# Altium schematic sheet instrumentacao.SchDoc
size A4
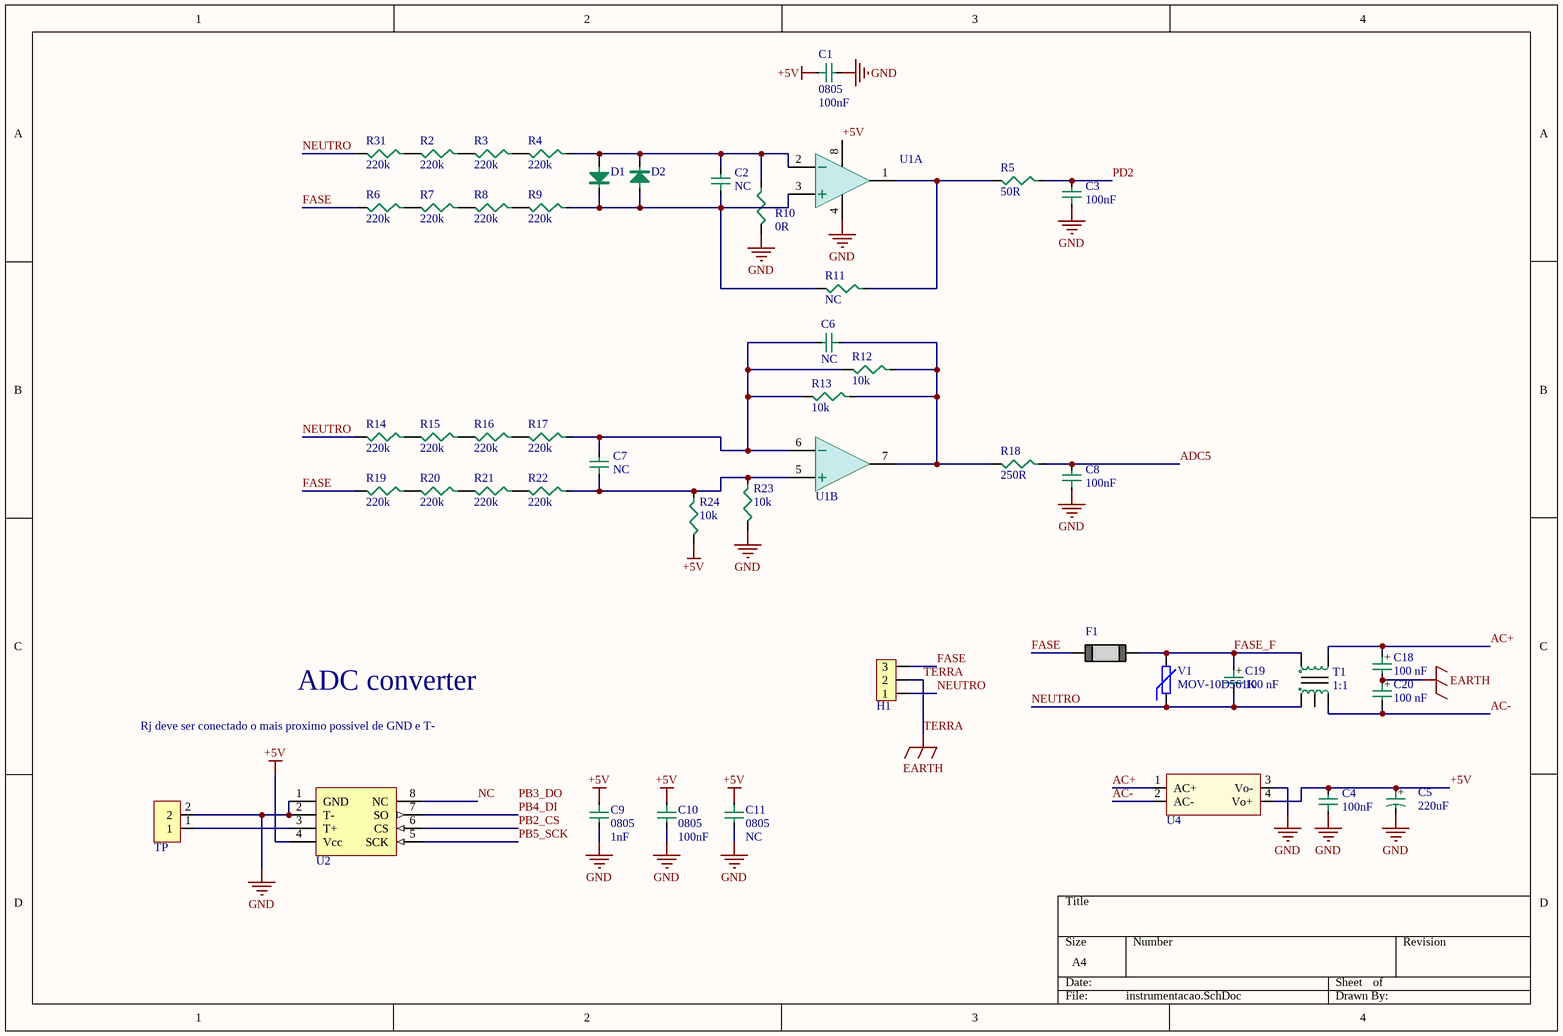
[diagram p0: instrumentacao.SchDoc]

## Parts
C1  0805  value 100nF  [0805C]
C2  value NC  [0805C]  (hidden comment: 0805)
C3  value 100nF  [0805C]  (hidden comment: 0805)
C4  value 100nF  [0805C]  (hidden comment: 0805)
C5  value 220uF  [CAP SMD D10.0 A10.2]  (hidden comment: D10.0 A10.2)
C6  value NC  [0805C]  (hidden comment: 0805)
C7  value NC  [0805C]  (hidden comment: 0805)
C8  value 100nF  [0805C]  (hidden comment: 0805)
C9  0805  value 1nF  [0805C]
C10  0805  value 100nF  [0805C]
C11  0805  value NC  [0805C]
C18  value 100 nF  [CAP FILM 10 mm Lead]  (hidden comment: Cap Film 22.5mm)
C19  value 100 nF  [CAP FILM 10 mm Lead]  (hidden comment: Cap Film 22.5mm)
C20  value 100 nF  [CAP FILM 10 mm Lead]  (hidden comment: Cap Film 22.5mm)
D1  1N4148 SMD  [DIODE SMD LL-34]  (value not drawn)
D2  1N4148 SMD  [DIODE SMD LL-34]  (value not drawn)
F1  5 x 20 mm  [Fuseholder 5 x 20 mm]  (value not drawn)
H1  Terminal Blocks 3 Pos 5.08mm  [BLOCK3P]  (value not drawn)
R2  value 220k  [0805]  (hidden comment: 0805)
R3  value 220k  [0805]  (hidden comment: 0805)
R4  value 220k  [0805]  (hidden comment: 0805)
R5  value 50R  [0805]  (hidden comment: 0805)
R6  value 220k  [0805]  (hidden comment: 0805)
R7  value 220k  [0805]  (hidden comment: 0805)
R8  value 220k  [0805]  (hidden comment: 0805)
R9  value 220k  [0805]  (hidden comment: 0805)
R10  value 0R  [0805]  (hidden comment: 0805)
R11  value NC  [0805]  (hidden comment: 0805)
R12  value 10k  [0805]  (hidden comment: 0805)
R13  value 10k  [0805]  (hidden comment: 0805)
R14  value 220k  [0805]  (hidden comment: 0805)
R15  value 220k  [0805]  (hidden comment: 0805)
R16  value 220k  [0805]  (hidden comment: 0805)
R17  value 220k  [0805]  (hidden comment: 0805)
R18  value 250R  [0805]  (hidden comment: 0805)
R19  value 220k  [0805]  (hidden comment: 0805)
R20  value 220k  [0805]  (hidden comment: 0805)
R21  value 220k  [0805]  (hidden comment: 0805)
R22  value 220k  [0805]  (hidden comment: 0805)
R23  value 10k  [0805]  (hidden comment: 0805)
R24  value 10k  [0805]  (hidden comment: 0805)
R31  value 220k  [0805]  (hidden comment: 0805)
T1  value 1:1  [Trafo_Driver]  (hidden comment: Transformador Driver)
TP  Molex_2  [Molex_2]  (value not drawn)
U1  CI Ampop Soic-8 generico  [SOIC 8]  (value not drawn)  (parts A,B of 2)
U2  MAX6675  [SOIC 8]  (value not drawn)
U4  5V supply*  [HILINK]  (value not drawn)
V1  MOV-10D561K  [VARISTOR 7.5mm]

## Nets
+5V: C1.1 C4.2 C5.1 C9.1 C10.1 C11.1 R24.2 U1.8(V+) U2.4(Vcc) U4.4(Vo+)
GND: C1.2 C3.1 C4.1 C5.2 C8.1 C9.2 C10.2 C11.2 R10.2 R23.2 TP.2 U1.4(V-) U2.1(GND) U2.2(T-) U4.3(Vo-)
TERRA: C18.2 C20.1 H1.2  [also labelled EARTH]
AC+: C18.1 T1.2 U4.1(AC+)
AC-: C20.2 T1.5 U4.2(AC-)
ADC5: C8.2 R18.1
FASE: F1.2 H1.3 R6.2 R19.2
FASE_F: C19.1 F1.1 T1.1 V1.2
NC: U2.8(NC)
NEUTRO: C19.2 H1.1 R14.2 R31.2 T1.3 V1.1
PB2_CS: U2.6(CS)
PB4_DI: U2.7(SO)
PB5_SCK: U2.5(SCK)
PD2: C3.2 R5.1
NetC2_1: C2.1 D1.K D2.A R9.1 R11.2 U1.3
NetC2_2: C2.2 D1.A D2.K R4.1 R10.1 U1.2
NetC6_1: C6.1 R12.1 R13.1 R18.2 U1.7
NetC6_2: C6.2 C7.2 R12.2 R13.2 R17.1 U1.6
NetC7_1: C7.1 R22.1 R23.1 R24.1 U1.5
NetR2_1: R2.1 R3.2
NetR2_2: R2.2 R31.1
NetR3_1: R3.1 R4.2
NetR5_2: R5.2 R11.1 U1.1
NetR6_1: R6.1 R7.2
NetR7_1: R7.1 R8.2
NetR8_1: R8.1 R9.2
NetR14_1: R14.1 R15.2
NetR15_1: R15.1 R16.2
NetR16_1: R16.1 R17.2
NetR19_1: R19.1 R20.2
NetR20_1: R20.1 R21.2
NetR21_1: R21.1 R22.2
NetTP_1: TP.1 U2.3(T+)

Not connected (* = marked no-connect by the designer): T1 4

## Notes on the sheet
- ADC converter
- Rj deve ser conectado o mais proximo possivel de GND e T-
- Labels drawn without touching a wire or pin: PB3_DO
- (in symbol Capacitor FILM 100nF 275 VAc) +
- (in symbol Capacitor SMD D10.0 A10.2) +

## Library data of the parts
C1-C4 C6-C11 = Capacitor SMD 0805
C5 = Capacitor SMD D10.0 A10.2: %: ±20%
C18-C20 = Capacitor FILM 100nF 275 VAc: Safety Capacitors 275VAC 0.1uF 10% LS 10mm X2; %: ±20%; Tensão: 200V; ComponentLink1Description: Mouser; ComponentLink1URL: https://www.mouser.com/ProductDetail/EPCOS-TDK/B32921Y2104K000?qs=TuK3vfAjtkXr4SycMmru8w%3D%3D
D1 D2 = Diodo Sinal SMD 1N4148: Diodo Sinal SMD LL-34
F1 = FuseHolder 5 x 20 mm: Fuseholder Open Design, 5 x 20 mm; Tensão: 500 VA; Corrente: 16A; DataSheet: https://br.mouser.com/datasheet/2/358/typ_OGN-14523.pdf; 3D Model: https://www.3dcontentcentral.com/secure/download-model.aspx?catalogid=171&id=541358
H1 = Header  Pos 5.08mm: Pluggable Terminal Blocks 3 Pos 5.08mm pitch Through Hole Header; ComponentLink1Description: mouser; ComponentLink1URL: https://br.mouser.com/ProductDetail/Phoenix-Contact/1757255?qs=uD%2FdkN7XIa0ez8xszzicKg%3D%3D; ComponentLink2Description: datasheet; ComponentLink2URL: https://br.mouser.com/datasheet/2/324/4/1757255-1440716.pdf
R2-R24 R31 = Resistor SMD 0805 1/8 W: %: ±1%; P: 1/8W
U2 = MAX6675: Cold-Junction-Compensated K-Thermocoupleto-Digital Converter (0°C to +1024°C); ComponentLink1Description: Datasheet; ComponentLink1URL: https://datasheets.maximintegrated.com/en/ds/MAX6675.pdf
U4 = HI-LINK PM01 3W: 5V 3W Ultra-small Power Module PM03; ComponentLink1Description: datasheet; ComponentLink1URL: https://datasheet.lcsc.com/szlcsc/1909111105_HI-LINK-HLK-PM24_C399250.pdf
V1 = Varistor: Varistors 180pF 560volts 10%; ComponentLink1Description: MOUSER; ComponentLink1URL: https://www.mouser.com/ProductDetail/Bourns/MOV-10D561K?qs=lgttKnAd%252B2ArrqGQgWwr6w%3D%3D